# Altium schematic sheet Main.SchDoc
size A1
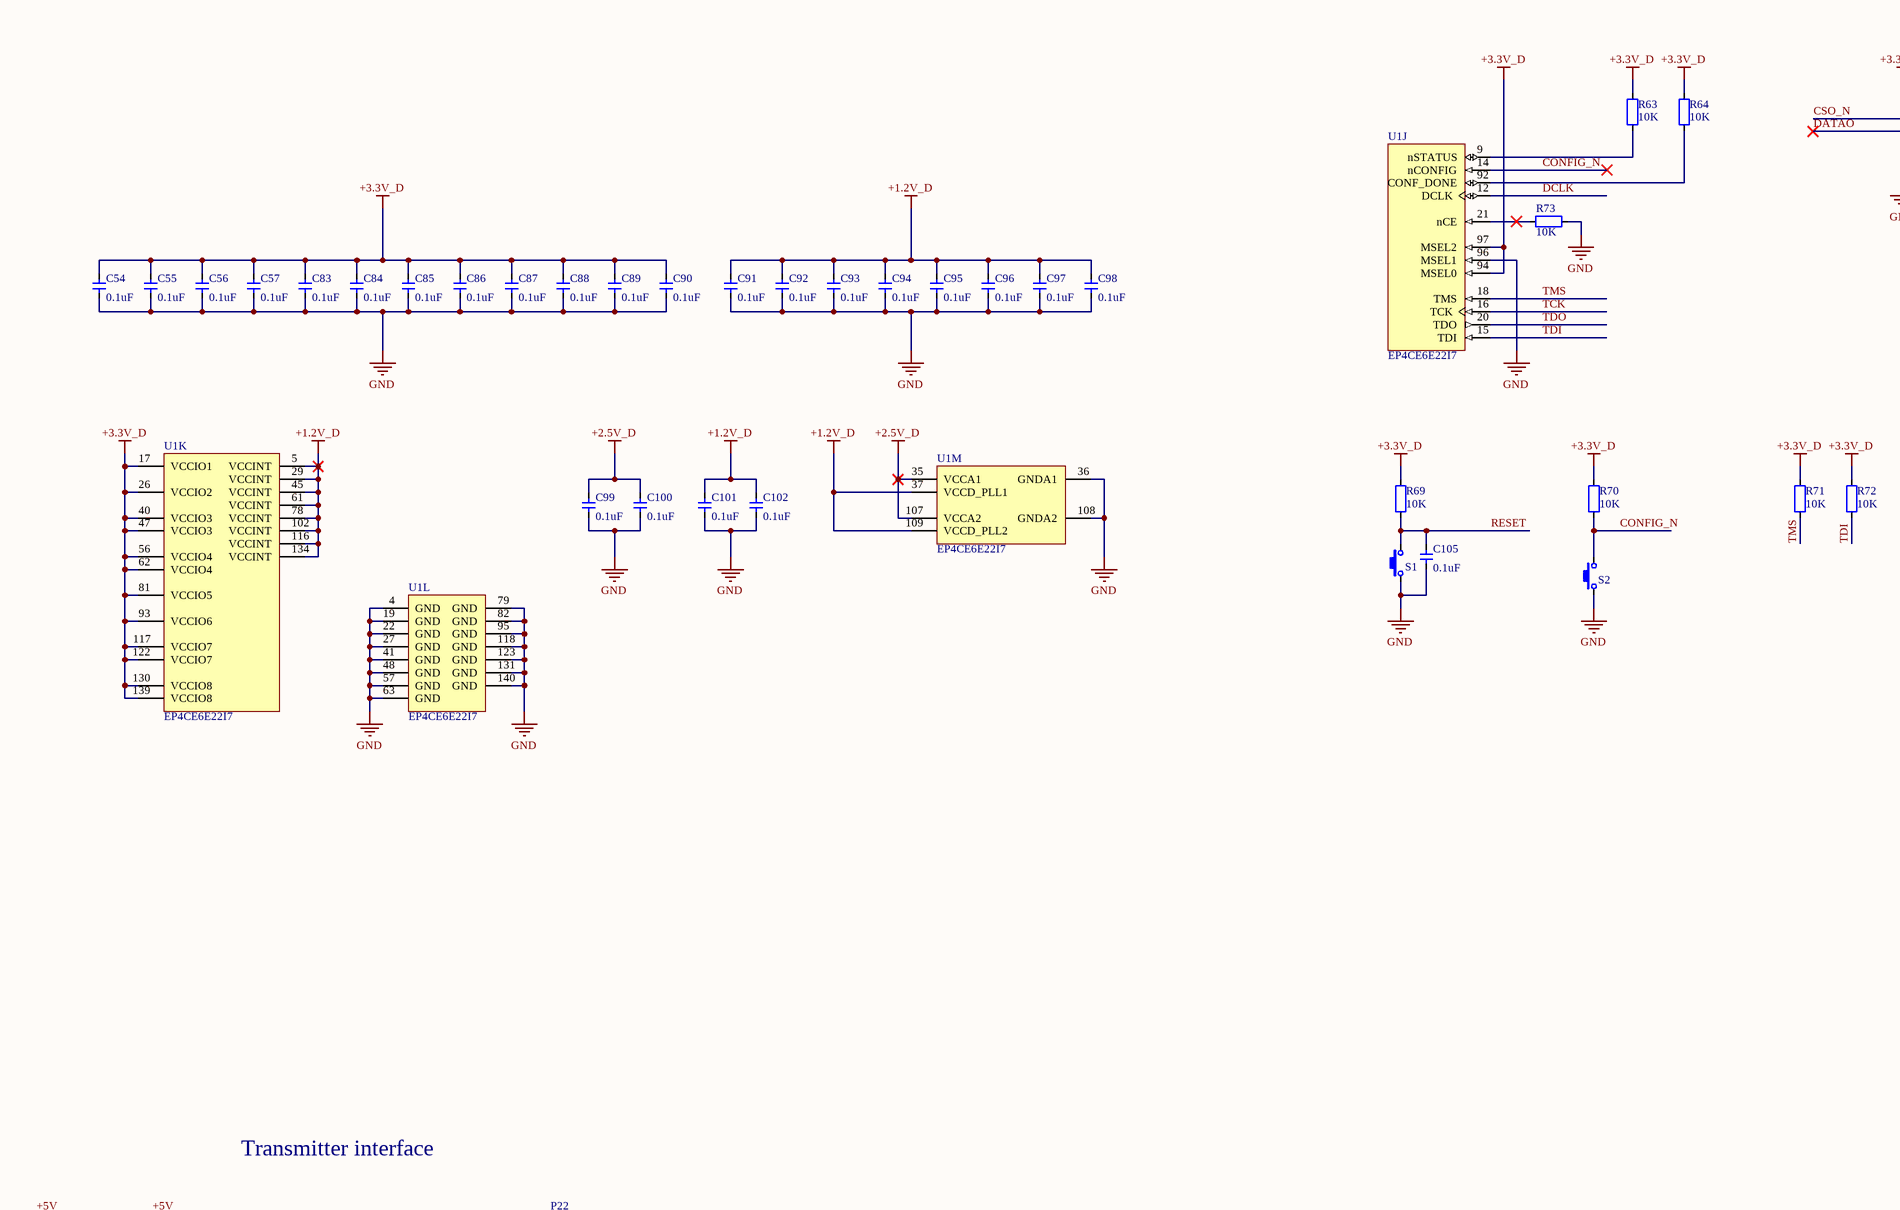
[diagram p0: Main.SchDoc, top left]
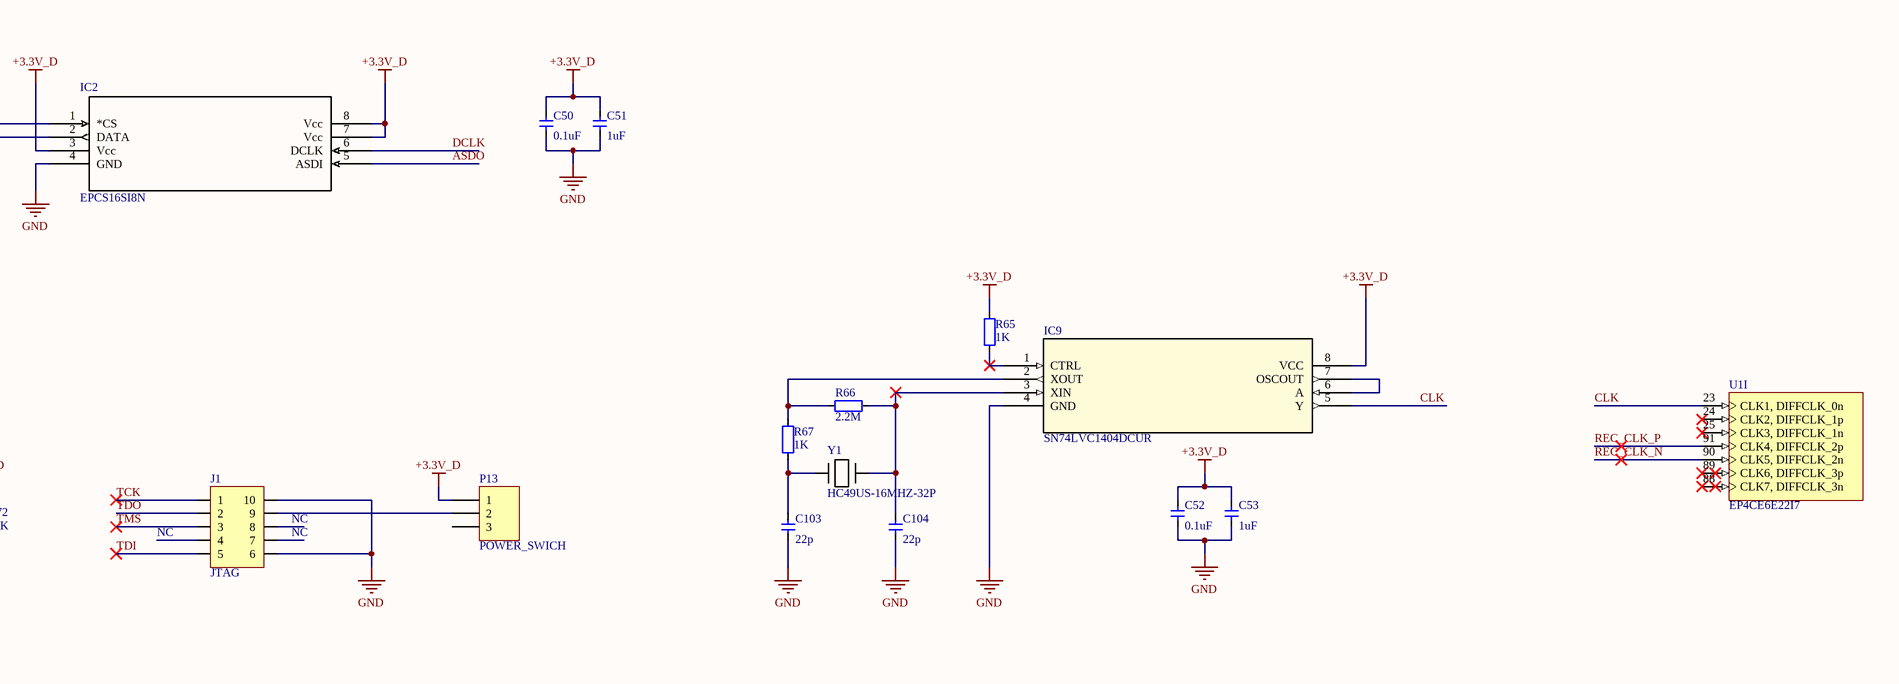
[diagram p1: Main.SchDoc, top right]
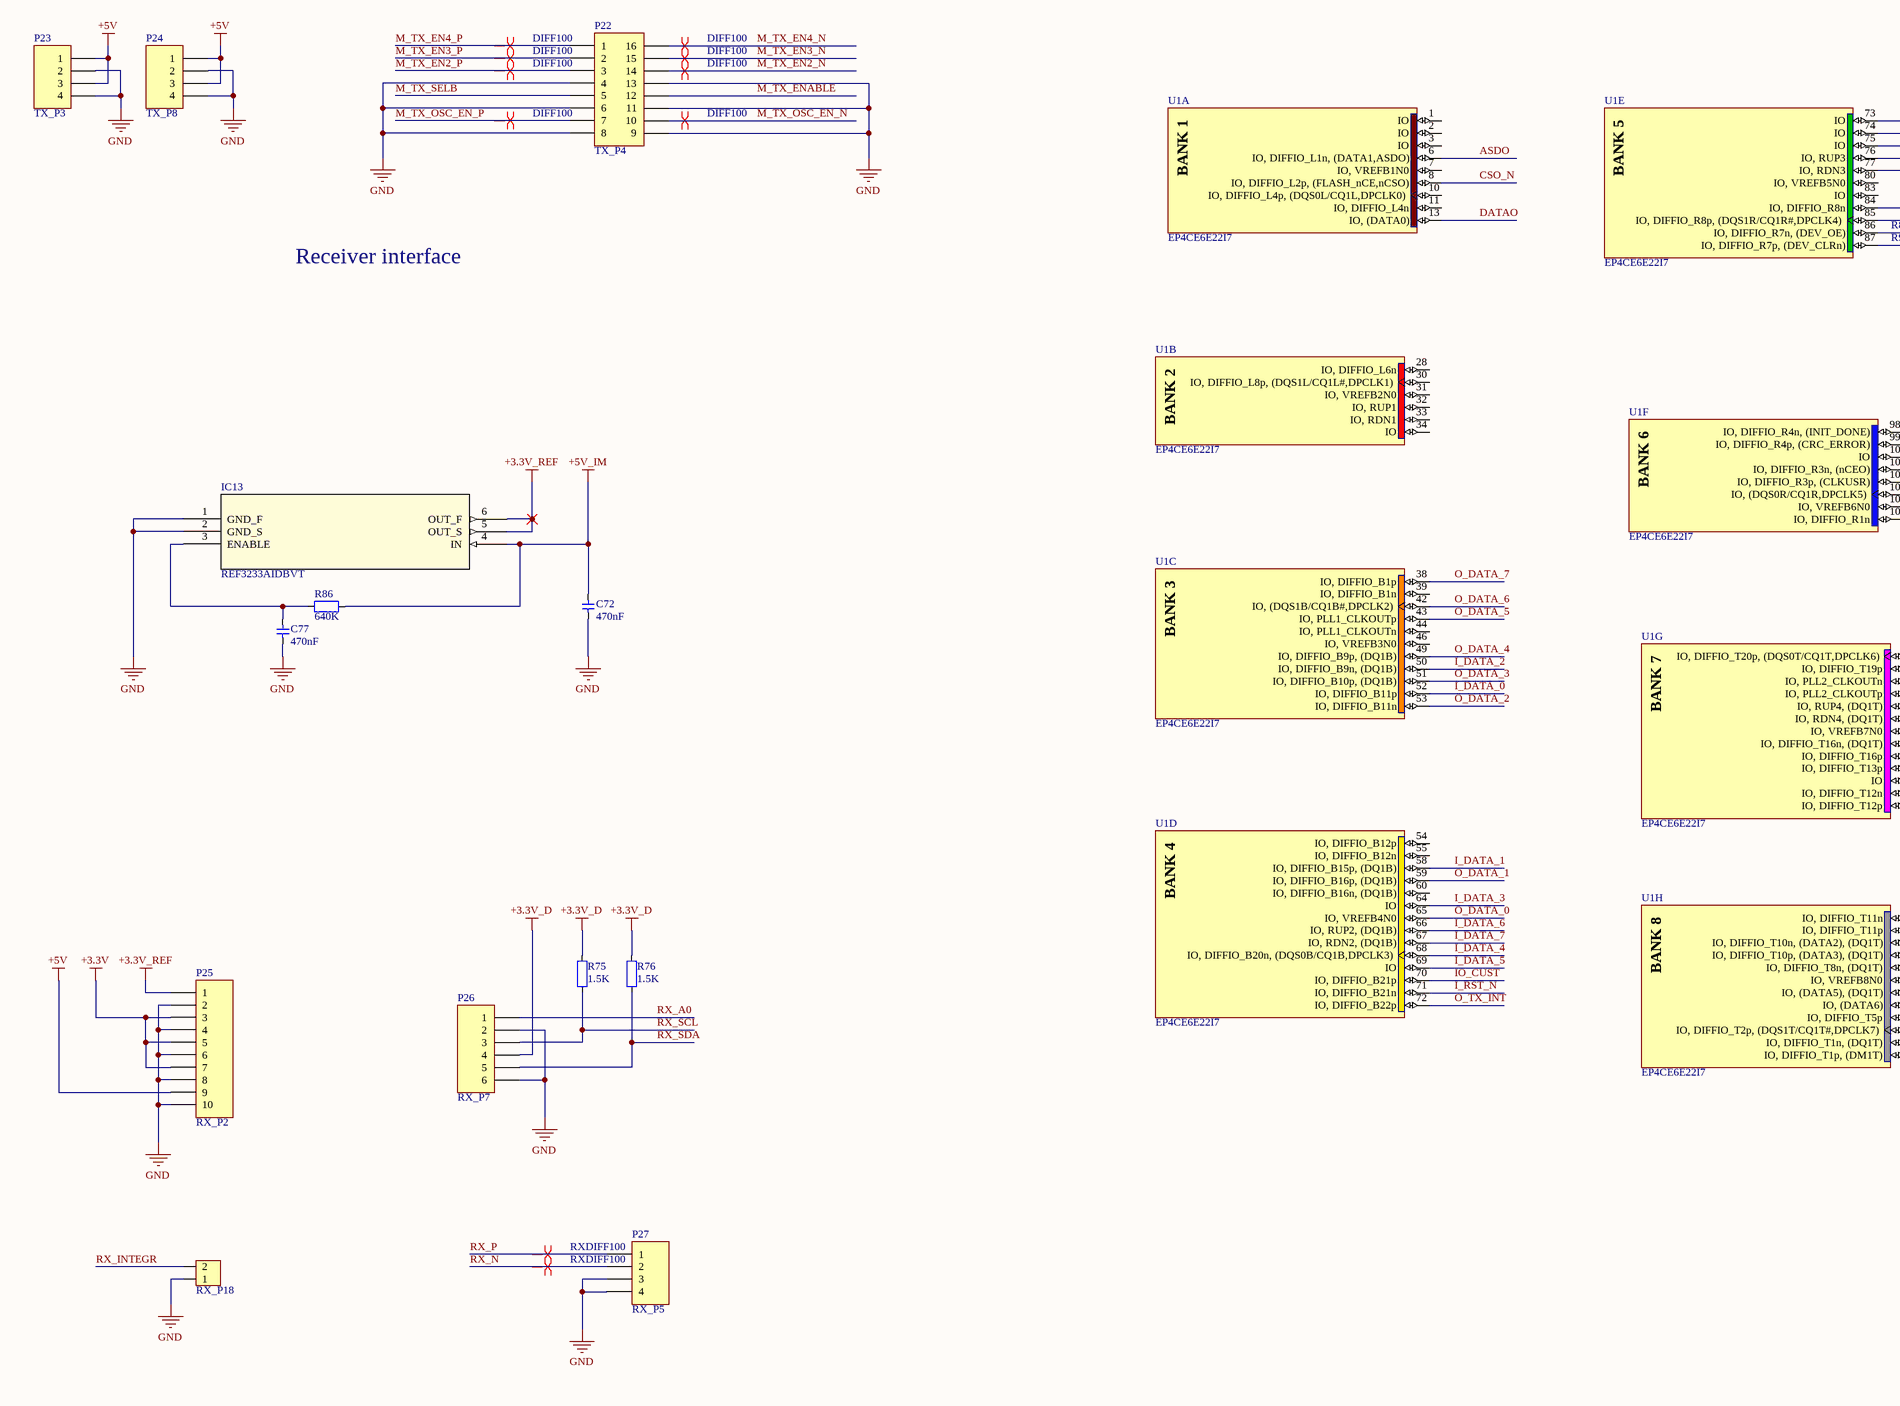
[diagram p2: Main.SchDoc, bottom left]
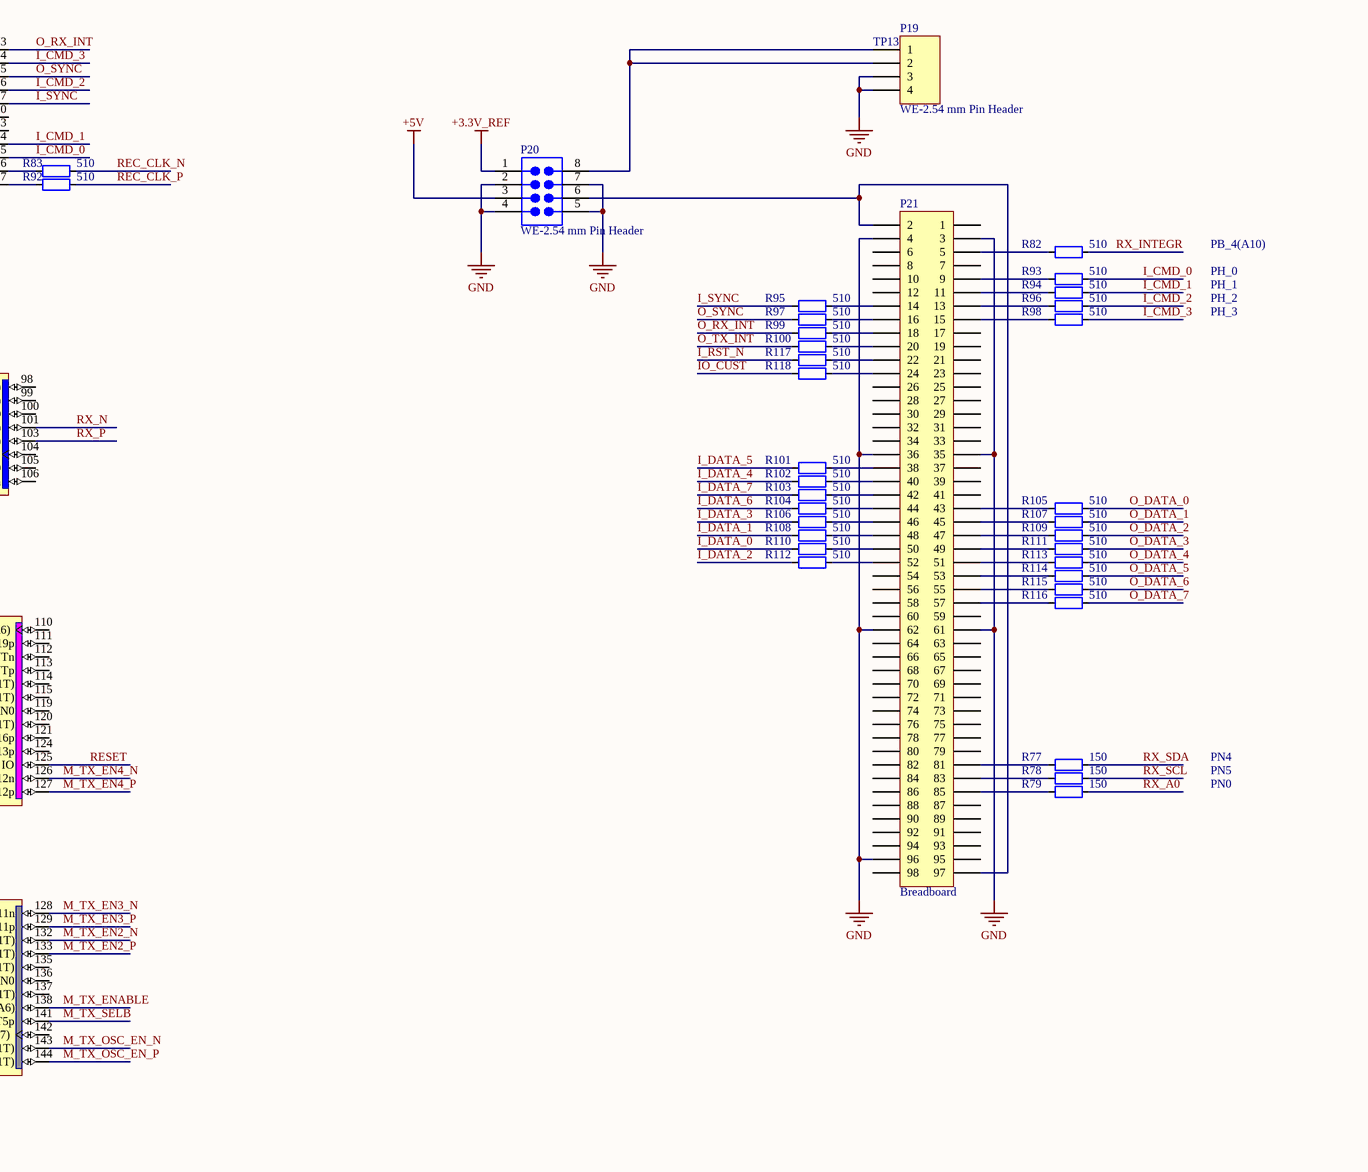
[diagram p3: Main.SchDoc, bottom right]

## Parts
C50  value 0.1uF  [CAP_0603]  (hidden comment: Cap_0603)
C51  value 1uF  [CAP_0603]  (hidden comment: Cap_0603)
C52  value 0.1uF  [CAP_0603]  (hidden comment: Cap_0603)
C53  value 1uF  [CAP_0603]  (hidden comment: Cap_0603)
C54  value 0.1uF  [CAP_0603]  (hidden comment: Cap_0603)
C55  value 0.1uF  [CAP_0603]  (hidden comment: Cap_0603)
C56  value 0.1uF  [CAP_0603]  (hidden comment: Cap_0603)
C57  value 0.1uF  [CAP_0603]  (hidden comment: Cap_0603)
C72  value 470nF  [CAP_0603]  (hidden comment: Cap_0603)
C77  value 470nF  [CAP_0603]  (hidden comment: Cap_0603)
C83  value 0.1uF  [CAP_0603]  (hidden comment: Cap_0603)
C84  value 0.1uF  [CAP_0603]  (hidden comment: Cap_0603)
C85  value 0.1uF  [CAP_0603]  (hidden comment: Cap_0603)
C86  value 0.1uF  [CAP_0603]  (hidden comment: Cap_0603)
C87  value 0.1uF  [CAP_0603]  (hidden comment: Cap_0603)
C88  value 0.1uF  [CAP_0603]  (hidden comment: Cap_0603)
C89  value 0.1uF  [CAP_0603]  (hidden comment: Cap_0603)
C90  value 0.1uF  [CAP_0603]  (hidden comment: Cap_0603)
C91  value 0.1uF  [CAP_0603]  (hidden comment: Cap_0603)
C92  value 0.1uF  [CAP_0603]  (hidden comment: Cap_0603)
C93  value 0.1uF  [CAP_0603]  (hidden comment: Cap_0603)
C94  value 0.1uF  [CAP_0603]  (hidden comment: Cap_0603)
C95  value 0.1uF  [CAP_0603]  (hidden comment: Cap_0603)
C96  value 0.1uF  [CAP_0603]  (hidden comment: Cap_0603)
C97  value 0.1uF  [CAP_0603]  (hidden comment: Cap_0603)
C98  value 0.1uF  [CAP_0603]  (hidden comment: Cap_0603)
C99  value 0.1uF  [CAP_0603]  (hidden comment: Cap_0603)
C100  value 0.1uF  [CAP_0603]  (hidden comment: Cap_0603)
C101  value 0.1uF  [CAP_0603]  (hidden comment: Cap_0603)
C102  value 0.1uF  [CAP_0603]  (hidden comment: Cap_0603)
C103  value 22p  [CAP_0603]  (hidden comment: Cap_0603)
C104  value 22p  [CAP_0603]  (hidden comment: Cap_0603)
C105  value 0.1uF  [CAP_0603]  (hidden comment: Cap_0603)
IC2  EPCS16SI8N  [8-SOIC]
IC9  SN74LVC1404DCUR  [DCU8]
IC13  REF3233AIDBVT  [DBV6]
J1  JTAG  [66101021622]
P13  POWER_SWICH  [61300311121]
P19  WE-2.54 mm Pin Header  [61000418221]
P20  WE-2.54 mm Pin Header  [610x0821121]
P21  Breadboard  [Breadboard]
P22  TX_P4  [61001621821]
P23  TX_P3  [61000411921]
P24  TX_P8  [61000411921]
P25  RX_P2  [61301011821]
P26  RX_P7  [61000613321]
P27  RX_P5  [61000413321]
R63  value 10K  [RES_0603]  (hidden comment: Res_0603)
R64  value 10K  [RES_0603]  (hidden comment: Res_0603)
R65  value 1K  [RES_0603]  (hidden comment: Res_0603)
R66  value 2.2M  [RES_0603]  (hidden comment: Res_0603)
R67  value 1K  [RES_0603]  (hidden comment: Res_0603)
R69  value 10K  [RES_0603]  (hidden comment: Res_0603)
R70  value 10K  [RES_0603]  (hidden comment: Res_0603)
R71  value 10K  [RES_0603]  (hidden comment: Res_0603)
R72  value 10K  [RES_0603]  (hidden comment: Res_0603)
R73  value 10K  [RES_0603]  (hidden comment: Res_0603)
R75  value 1.5K  [RES_0603]  (hidden comment: Res_0603)
R76  value 1.5K  [RES_0603]  (hidden comment: Res_0603)
R77  value 150  [RES_0603]  (hidden comment: Res_0603)
R78  value 150  [RES_0603]  (hidden comment: Res_0603)
R79  value 150  [RES_0603]  (hidden comment: Res_0603)
R82  value 510  [RES_0603]  (hidden comment: Res_0603)
R83  value 510  [RES_0603]  (hidden comment: Res_0603)
R86  value 640K  [RES_0603]  (hidden comment: Res_0603)
R92  value 510  [RES_0603]  (hidden comment: Res_0603)
R93  value 510  [RES_0603]  (hidden comment: Res_0603)
R94  value 510  [RES_0603]  (hidden comment: Res_0603)
R95  value 510  [RES_0603]  (hidden comment: Res_0603)
R96  value 510  [RES_0603]  (hidden comment: Res_0603)
R97  value 510  [RES_0603]  (hidden comment: Res_0603)
R98  value 510  [RES_0603]  (hidden comment: Res_0603)
R99  value 510  [RES_0603]  (hidden comment: Res_0603)
R100  value 510  [RES_0603]  (hidden comment: Res_0603)
R101  value 510  [RES_0603]  (hidden comment: Res_0603)
R102  value 510  [RES_0603]  (hidden comment: Res_0603)
R103  value 510  [RES_0603]  (hidden comment: Res_0603)
R104  value 510  [RES_0603]  (hidden comment: Res_0603)
R105  value 510  [RES_0603]  (hidden comment: Res_0603)
R106  value 510  [RES_0603]  (hidden comment: Res_0603)
R107  value 510  [RES_0603]  (hidden comment: Res_0603)
R108  value 510  [RES_0603]  (hidden comment: Res_0603)
R109  value 510  [RES_0603]  (hidden comment: Res_0603)
R110  value 510  [RES_0603]  (hidden comment: Res_0603)
R111  value 510  [RES_0603]  (hidden comment: Res_0603)
R112  value 510  [RES_0603]  (hidden comment: Res_0603)
R113  value 510  [RES_0603]  (hidden comment: Res_0603)
R114  value 510  [RES_0603]  (hidden comment: Res_0603)
R115  value 510  [RES_0603]  (hidden comment: Res_0603)
R116  value 510  [RES_0603]  (hidden comment: Res_0603)
R117  value 510  [RES_0603]  (hidden comment: Res_0603)
R118  value 510  [RES_0603]  (hidden comment: Res_0603)
RX_P18  HDR1x2_2.54  [HDR1X2_2.54_180F]  (value not drawn)
S1  ButtonTACT_3x6x2.5_180  [ButtonTACT_3x6x2.5_180]  (value not drawn)
S2  ButtonTACT_3x6x2.5_180  [ButtonTACT_3x6x2.5_180]  (value not drawn)
U1  EP4CE6E22I7  [EQFP144_N]  (parts A,B,C,D,E,F,G,H,I,J,K,L,M of 13)
Y1  HC49US-16MHZ-32P  [H25]

## Nets
+1.2V_D: C91.2 C92.2 C93.2 C94.2 C95.2 C96.2 C97.2 C98.2 C101.2 C102.2 U1.5(VCCINT) U1.29(VCCINT) U1.37(VCCD_PLL1) U1.45(VCCINT) U1.61(VCCINT) U1.78(VCCINT) U1.102(VCCINT) U1.109(VCCD_PLL2) U1.116(VCCINT) U1.134(VCCINT)
+2.5V_D: C99.2 C100.2 U1.35(VCCA1) U1.107(VCCA2)
+3.3V: P25.3 P25.5 P25.7
+3.3V_D: C50.2 C51.2 C52.2 C53.2 C54.2 C55.2 C56.2 C57.2 C83.2 C84.2 C85.2 C86.2 C87.2 C88.2 C89.2 C90.2 IC2.3(Vcc) IC2.7(Vcc) IC2.8(Vcc) IC9.8(VCC) P13.1 P26.4 R63.1 R64.1 R65.1 R69.1 R70.1 R71.1 R72.1 R75.2 R76.2 U1.17(VCCIO1) U1.26(VCCIO2) U1.40(VCCIO3) U1.47(VCCIO3) U1.56(VCCIO4) U1.62(VCCIO4) U1.81(VCCIO5) U1.93(VCCIO6) U1.94(MSEL0) U1.97(MSEL2) U1.117(VCCIO7) U1.122(VCCIO7) U1.130(VCCIO8) U1.139(VCCIO8)
+3.3V_REF: IC13.5(OUT_S) IC13.6(OUT_F) P20.1 P25.1
+5V: P20.3 P23.1 P23.3 P24.1 P24.3 P25.9
+5V_IM: C72.2 IC13.4(IN) R86.2
GND: C50.1 C51.1 C52.1 C53.1 C54.1 C55.1 C56.1 C57.1 C72.1 C77.1 C83.1 C84.1 C85.1 C86.1 C87.1 C88.1 C89.1 C90.1 C91.1 C92.1 C93.1 C94.1 C95.1 C96.1 C97.1 C98.1 C99.1 C100.1 C101.1 C102.1 C103.1 C104.1 C105.1 IC2.4(GND) IC9.4(GND) IC13.1(GND_F) IC13.2(GND_S) J1.6 J1.10 P19.3 P19.4 P20.2 P20.4 P20.5 P20.7 P21.3 P21.4 P21.35 P21.36 P21.61 P21.62 P21.96 P22.4 P22.6 P22.8 P22.9 P22.11 P22.13 P23.2 P23.4 P24.2 P24.4 P25.2 P25.4 P25.6 P25.8 P25.10 P26.2 P26.6 P27.3 P27.4 R73.2 RX_P18.1 S1.1 S2.1 U1.4(GND) U1.19(GND) U1.22(GND) U1.27(GND) U1.36(GNDA1) U1.41(GND) U1.48(GND) U1.57(GND) U1.63(GND) U1.79(GND) U1.82(GND) U1.95(GND) U1.96(MSEL1) U1.108(GNDA2) U1.118(GND) U1.123(GND) U1.131(GND) U1.140(GND)
ASDO: IC2.5(ASDI) U1.6(IO,_DIFFIO_L1n,_(DATA1,ASDO))
CLK: IC9.5(Y) U1.23(CLK1,_DIFFCLK_0n)
CONFIG_N: R70.2 S2.2 U1.14(nCONFIG)
CSO_N: IC2.1(*CS) U1.8(IO,_DIFFIO_L2p,_(FLASH_nCE,nCSO))
DATAO: IC2.2(DATA) U1.13(IO,_(DATA0))
DCLK: IC2.6(DCLK) U1.12(DCLK)
I_CMD_0: R93.1 U1.85(IO,_DIFFIO_R8p,_(DQS1R/CQ1R#,DPCLK4))
I_CMD_1: R94.1 U1.84(IO,_DIFFIO_R8n)
I_CMD_2: R96.1 U1.76(IO,_RUP3)
I_CMD_3: R98.1 U1.74(IO)
I_DATA_0: R110.2 U1.52(IO,_DIFFIO_B11p)
I_DATA_1: R108.2 U1.58(IO,_DIFFIO_B15p,_(DQ1B))
I_DATA_2: R112.2 U1.50(IO,_DIFFIO_B9n,_(DQ1B))
I_DATA_3: R106.2 U1.64(IO)
I_DATA_4: R102.2 U1.68(IO,_DIFFIO_B20n,_(DQS0B/CQ1B,DPCLK3))
I_DATA_5: R101.2 U1.69(IO)
I_DATA_6: R104.2 U1.66(IO,_RUP2,_(DQ1B))
I_DATA_7: R103.2 U1.67(IO,_RDN2,_(DQ1B))
I_RST_N: R117.2 U1.71(IO,_DIFFIO_B21n)
I_SYNC: R95.2 U1.77(IO,_RDN3)
IO_CUST: R118.2 U1.70(IO,_DIFFIO_B21p)
M_TX_EN2_N: P22.14 U1.132(IO,_DIFFIO_T10n,_(DATA2),_(DQ1T))
M_TX_EN2_P: P22.3 U1.133(IO,_DIFFIO_T10p,_(DATA3),_(DQ1T))
M_TX_EN3_N: P22.15 U1.128(IO,_DIFFIO_T11n)
M_TX_EN3_P: P22.2 U1.129(IO,_DIFFIO_T11p)
M_TX_EN4_N: P22.16 U1.126(IO,_DIFFIO_T12n)
M_TX_EN4_P: P22.1 U1.127(IO,_DIFFIO_T12p)
M_TX_ENABLE: P22.12 U1.138(IO,_(DATA6))
M_TX_OSC_EN_N: P22.10 U1.143(IO,_DIFFIO_T1n,_(DQ1T))
M_TX_OSC_EN_P: P22.7 U1.144(IO,_DIFFIO_T1p,_(DM1T))
M_TX_SELB: P22.5 U1.141(IO,_DIFFIO_T5p)
O_DATA_0: R105.1 U1.65(IO,_VREFB4N0)
O_DATA_1: R107.1 U1.59(IO,_DIFFIO_B16p,_(DQ1B))
O_DATA_2: R109.1 U1.53(IO,_DIFFIO_B11n)
O_DATA_3: R111.1 U1.51(IO,_DIFFIO_B10p,_(DQ1B))
O_DATA_4: R113.1 U1.49(IO,_DIFFIO_B9p,_(DQ1B))
O_DATA_5: R114.1 U1.43(IO,_PLL1_CLKOUTp)
O_DATA_6: R115.1 U1.42(IO,_(DQS1B/CQ1B#,DPCLK2))
O_DATA_7: R116.1 U1.38(IO,_DIFFIO_B1p)
O_RX_INT: R99.2 U1.73(IO)
O_SYNC: R97.2 U1.75(IO)
O_TX_INT: R100.2 U1.72(IO,_DIFFIO_B22p)
REC_CLK_N: R83.1 U1.90(CLK5,_DIFFCLK_2n)
REC_CLK_P: R92.1 U1.91(CLK4,_DIFFCLK_2p)
RESET: C105.2 R69.2 S1.2 U1.125(IO)
RX_A0: P26.1 R79.1
RX_INTEGR: R82.1 RX_P18.2
RX_N: P27.2 U1.101(IO,_DIFFIO_R3n,_(nCEO))
RX_P: P27.1 U1.103(IO,_DIFFIO_R3p,_(CLKUSR))
RX_SCL: P26.3 R75.1 R78.1
RX_SDA: P26.5 R76.1 R77.1
TCK: J1.1 U1.16(TCK)
TDI: J1.5 R72.2 U1.15(TDI)
TDO: J1.2 U1.20(TDO)
TMS: J1.3 R71.2 U1.18(TMS)
NetC77_2: C77.2 IC13.3(ENABLE) R86.1
NetC103_2: C103.2 R67.2 Y1.1
NetC104_2: C104.2 IC9.3(XIN) R66.1 Y1.2
NetIC9_1: IC9.1(CTRL) R65.2
NetIC9_2: IC9.2(XOUT) R66.2 R67.1
NetIC9_6: IC9.6(A) IC9.7(OSCOUT)
NetJ1_9: J1.9 P13.2
NetP19_1: P19.1 P19.2 P20.8
NetP20_6: P20.6 P21.2 P21.97
NetP21_5: P21.5 R82.2
NetP21_9: P21.9 R93.2
NetP21_11: P21.11 R94.2
NetP21_13: P21.13 R96.2
NetP21_14: P21.14 R95.1
NetP21_15: P21.15 R98.2
NetP21_16: P21.16 R97.1
NetP21_18: P21.18 R99.1
NetP21_20: P21.20 R100.1
NetP21_22: P21.22 R117.1
NetP21_24: P21.24 R118.1
NetP21_38: P21.38 R101.1
NetP21_40: P21.40 R102.1
NetP21_42: P21.42 R103.1
NetP21_43: P21.43 R105.2
NetP21_44: P21.44 R104.1
NetP21_45: P21.45 R107.2
NetP21_46: P21.46 R106.1
NetP21_47: P21.47 R109.2
NetP21_48: P21.48 R108.1
NetP21_49: P21.49 R111.2
NetP21_50: P21.50 R110.1
NetP21_51: P21.51 R113.2
NetP21_52: P21.52 R112.1
NetP21_53: P21.53 R114.2
NetP21_55: P21.55 R115.2
NetP21_57: P21.57 R116.2
NetP21_81: P21.81 R77.2
NetP21_83: P21.83 R78.2
NetP21_85: P21.85 R79.2
NetR63_2: R63.2 U1.9(nSTATUS)
NetR64_2: R64.2 U1.92(CONF_DONE)
NetR73_1: R73.1 U1.21(nCE)
NetR83_2: R83.2 U1.86(IO,_DIFFIO_R7n,_(DEV_OE))
NetR92_2: R92.2 U1.87(IO,_DIFFIO_R7p,_(DEV_CLRn))

Not connected (* = marked no-connect by the designer): J1 4 7 8; P13 3; P21 1 6 7 8 10 12 17 19 21 23 25 26 27 28 29 30 31 32 33 34 37 39 41 54 56 58 59 60 63 64 65 66 67 68 69 70 71 72 73 74 75 76 77 78 79 80 82 84 86 87 88 89 90 91 92 93 94 95 98; U1 1(IO) 2(IO) 3(IO) 7(IO,_VREFB1N0) 10(IO,_DIFFIO_L4p,_(DQS0L/CQ1L,DPCLK0)) 11(IO,_DIFFIO_L4n) 24(CLK2,_DIFFCLK_1p)* 25(CLK3,_DIFFCLK_1n)* 28(IO,_DIFFIO_L6n) 30(IO,_DIFFIO_L8p,_(DQS1L/CQ1L#,DPCLK1)) 31(IO,_VREFB2N0) 32(IO,_RUP1) 33(IO,_RDN1) 34(IO) 39(IO,_DIFFIO_B1n) 44(IO,_PLL1_CLKOUTn) 46(IO,_VREFB3N0) 54(IO,_DIFFIO_B12p) 55(IO,_DIFFIO_B12n) 60(IO,_DIFFIO_B16n,_(DQ1B)) 80(IO,_VREFB5N0) 83(IO) 88(CLK7,_DIFFCLK_3n)* 89(CLK6,_DIFFCLK_3p)* 98(IO,_DIFFIO_R4n,_(INIT_DONE)) 99(IO,_DIFFIO_R4p,_(CRC_ERROR)) 100(IO) 104(IO,_(DQS0R/CQ1R,DPCLK5)) 105(IO,_VREFB6N0) 106(IO,_DIFFIO_R1n) 110(IO,_DIFFIO_T20p,_(DQS0T/CQ1T,DPCLK6)) 111(IO,_DIFFIO_T19p) 112(IO,_PLL2_CLKOUTn) 113(IO,_PLL2_CLKOUTp) 114(IO,_RUP4,_(DQ1T)) 115(IO,_RDN4,_(DQ1T)) 119(IO,_VREFB7N0) 120(IO,_DIFFIO_T16n,_(DQ1T)) 121(IO,_DIFFIO_T16p) 124(IO,_DIFFIO_T13p) 135(IO,_DIFFIO_T8n,_(DQ1T)) 136(IO,_VREFB8N0) 137(IO,_(DATA5),_(DQ1T)) 142(IO,_DIFFIO_T2p,_(DQS1T/CQ1T#,DPCLK7))

## Layout directives
differential pair; net class DIFF100: M_TX_EN2_N, M_TX_EN2_P, M_TX_EN3_N, M_TX_EN3_P, M_TX_EN4_N, M_TX_EN4_P, M_TX_OSC_EN_N, M_TX_OSC_EN_P
differential pair; net class RXDIFF100: RX_N, RX_P

## Notes on the sheet
- (near J1) NC
- Transmitter interface
- (near P19) TP13
- Receiver interface
- PB_4(A10)
- PH_0
- PH_1
- PH_2
- PH_3
- PN4
- PN5
- PN0
- (in symbol EP4CE6E22I7, part A) BANK 1
- (in symbol EP4CE6E22I7, part B) BANK 2
- (in symbol EP4CE6E22I7, part C) BANK 3
- (in symbol EP4CE6E22I7, part D) BANK 4
- (in symbol EP4CE6E22I7, part E) BANK 5
- (in symbol EP4CE6E22I7, part F) BANK 6
- (in symbol EP4CE6E22I7, part G) BANK 7
- (in symbol EP4CE6E22I7, part H) BANK 8

## Library data of the parts
C50-C57 C72 C77 C83-C105 = Cap_0603: Capacitor
IC2 = EPCS16SI8N: Imported; Voltage - Supply: 3 V ~ 3.6 V; Memory Size: 16Mb; Programmable Type: In System Programmable; Vendor: Altera; C: Copyright (C) 2015 Accelerated Designs. All rights reserved; NewarkPartNumber: 80P4116; Operating Temperature: -40В°C ~ 85В°C; Packaging: Tube; Package / Case: 8-SOIC (0.154", 3.90mm Width); DigiKeyPartNumber: 544-2567-5-ND; Manufacturer_Part_Number: EPCS16SI8N; Quantity_Available: 6694; DataSheet: http://www.altera.com/literature/hb/cfg/cyc_c51014.pdf; Supplier Device Package: 8-SOIC; Copyright: Copyright (C) 2015 Accelerated Designs. All rights reserved; RefDes: RefDes; Type: DEV; Value: Value
IC9 = SN74LVC1404DCUR: Imported; Vendor: Texas Instruments; PACKAGE_DESIGNATOR: DCU; PIN_COUNT: 8; FAMILY_NAME: INVERTING BUFFER/DRIVER; INDUSTRY_STD_PKG_TYPE: US8; 3D_Library_Name: TI_AllParts_2012-12-25; C: Copyright (C) 2015 Accelerated Designs. All rights reserved; Manufacturer_Part_Number: SN74LVC1404DCUR; GENERIC_PART_NUMBER: SN74LVC1404; Datasheet URL: http://www.ti.com/lit/gpn/SN74LVC1404; Manufacturer: Texas Instruments; Copyright: Copyright (C) 2015 Accelerated Designs. All rights reserved; RefDes: RefDes; Type: DEV; Value: Value
IC13 = REF3233AIDBVT: Imported; Manufacturer: Texas Instruments; Manufacturer_Part_Number: ref3233_dbv_6; INDUSTRY_STD_PKG_TYPE: SOT-23; FAMILY_NAME: SERIES VOLTAGE REFERENCE; PIN_COUNT: 6; PACKAGE_DESIGNATOR: DBV; C: Copyright (C) 2015 Accelerated Designs. All rights reserved; Datasheet URL: http://www.ti.com/lit/gpn/REF3233; GENERIC_PART_NUMBER: REF3233; Vendor: Texas Instruments; Copyright: Copyright (C) 2015 Accelerated Designs. All rights reserved; RefDes: RefDes; Type: DEV; Value: Value
J1 = WR-WTB, 66101021622: WR-WTB 2.54mm Shrouded Header_Straight; Manufacturer: Wurth Elektronik; ComponentLink1 Description: Manufacturer; ComponentLink2 Description: Datasheet; NoPins: 10; Created Date: 9.Oct.2015; partNo: 66101021622; ComponentLink1URL: http://www.we-online.com; ComponentLink2URL: http://katalog.we-online.de/em/datasheet/6610XX11622.pdf; Created by: Baojun Chen
P13 = WE-2.54 mm Pin Header & Jumper 61300311121: WR-PHD 2.54mm Pin Header; Manufacturer: WЁ№rth Elektronik eiSos GmbH; ComponentLink1 Description: Manufacturer; ComponentLink2 Description: Datasheet; NoPins: 03; Created Date: 22 March 2013; partNo: 61300311121; ComponentLink1URL: http://www.we-online.com; ComponentLink2URL: http://katalog.we-online.de/em/datasheet/6130xx11121.pdf; Created by: Karrer Zheng
P19 = WE-2.54 mm Pin Header & Jumper 61000418221: WR-PHD 2.54 mm SMT Pin Header; Manufacturer: WЁ№rth Elektronik eiSos GmbH; ComponentLink1 Description: Manufacturer; ComponentLink2 Description: Datasheet; NoPins: 04; Created Date: 26 March 2013; partNo: 61000418221; ComponentLink1URL: http://www.we-online.com; ComponentLink2URL: http://katalog.we-online.de/em/datasheet/6100xx18221.pdf; Created by: Karrer Zheng
P20 = WE-2.54 mm Pin Header & Jumper 610x0821121: WR-PHD 2.54 mm Dual SMT Pin Header; Manufacturer: WЁ№rth Elektronik eiSos GmbH; ComponentLink1 Description: Manufacturer; ComponentLink2 Description: Datasheet; NoPins: 08; Created Date: 22 March 2013; partNo: 610x0821121; ComponentLink1URL: http://www.we-online.com; ComponentLink2URL: http://katalog.we-online.de/em/datasheet/6100xx21121.pdf; Created by: Karrer Zheng
P21 = Breadboard connection 2.54mm: NoPins: 98; Created Date: 3 July 2016; Created by: Maksym Hilliaka
P22 = WE-2.54 mm Socket Header 61001621821: WR-PHD 2.54 mm Dual SMT Socket Header; Manufacturer: WЁ№rth Elektronik eiSos GmbH; ComponentLink1 Description: Manufacturer; ComponentLink2 Description: Datasheet; NoPins: 16; Created Date: 29 March 2013; partNo: 61001621821; ComponentLink1URL: http://www.we-online.com; ComponentLink2URL: http://katalog.we-online.de/em/datasheet/6100xx21821.pdf; Created by: Karrer Zheng
P23 P24 = WE-2.54 mm Socket Header 61000411921: WR-PHD 2.54 mm SMT Socket Header; Manufacturer: WЁ№rth Elektronik eiSos GmbH; ComponentLink1 Description: Manufacturer; ComponentLink2 Description: Datasheet; NoPins: 4; Created Date: 29 March 2013; partNo: 61000411921; ComponentLink1URL: http://www.we-online.com; ComponentLink2URL: http://katalog.we-online.de/em/datasheet/6100xx11921.pdf; Created by: Karrer Zheng
P25 = WE-2.54 mm Socket Header 61301011821: WR-PHD 2.54 mm Socket Header; Manufacturer: WЁ№rth Elektronik eiSos GmbH; ComponentLink1 Description: Manufacturer; ComponentLink2 Description: Datasheet; NoPins: 10; Created Date: 29 March 2013; partNo: 61301011821; ComponentLink1URL: http://www.we-online.com; ComponentLink2URL: http://katalog.we-online.de/em/datasheet/6130xx11821.pdf; Created by: Karrer Zheng
P26 = WE-2.54 mm Socket Header 61000613321: WR-PHD 2.54 mm SMT Socket Header; Manufacturer: WЁ№rth Elektronik eiSos GmbH; ComponentLink1 Description: Manufacturer; ComponentLink2 Description: Datasheet; NoPins: 6; Created Date: 29 March 2013; partNo: 61000613321; ComponentLink1URL: http://www.we-online.com; ComponentLink2URL: http://katalog.we-online.de/em/datasheet/6100xx11921.pdf; Created by: Karrer Zheng
P27 = WE-2.54 mm Socket Header 61000413321: WR-PHD 2.54 mm SMT Socket Header; Manufacturer: WЁ№rth Elektronik eiSos GmbH; ComponentLink1 Description: Manufacturer; ComponentLink2 Description: Datasheet; NoPins: 4; Created Date: 29 March 2013; partNo: 61000413321; ComponentLink1URL: http://www.we-online.com; ComponentLink2URL: http://katalog.we-online.de/em/datasheet/6100xx11921.pdf; Created by: Karrer Zheng
R63-R67 R69-R73 R75-R79 R82 R83 R86 R92-R118 = Res_0603: Resistor
RX_P18 = HDR1x2_2.54T: Header
S1 S2 = ButtonTACT_3x6x2.5_180: Button
U1 = EP4CE6E22I7: Cyclone IV Family FPGA, 2V Core, 91 I/O Pins, 2 PLLs, 144-Pin QFP, Speed Grade 7, Industrial Grade; Published: 3-May-2010; DatasheetVersion: ver1.2, Mar-2010; PackageVersion: ver16.0, Dec-2009; PackageReference: EQFP144; Publisher: Altium Limited; PackageDescription: 144-Pin Plastic Enhanced Quad Flat Pack (EQFP144) - Wire Bond; Supplier 1: Digi-Key; Supplier Part Number 1: EP4CE6E22I7-ND; Code_JEDEC: MS-026-BFB; ComponentLink1Description: Manufacturer Link; ComponentLink1URL: http://www.altera.com/; ComponentLink2Description: Handbook; ComponentLink2URL: http://www.altera.com/literature/hb/cyclone-iv/cyclone4-handbook.pdf; ComponentLink3Description: Pinout Specification; ComponentLink3URL: http://www.altera.com/literature/lit-dp.jsp?category=cyc%204&showspreadsheet=y; ComponentLink4Description: Packaging Specification; ComponentLink4URL: http://www.altera.com/literature/ds/dspkg.pdf
Y1 = HC49US-25MHZ-32P: Imported; Manufacturer_Part_Number: HC49/US-25MHz-32pF-3OT-30-EXT-SMD-H25-TR; Vendor: Rami Technology; C: Copyright (C) 2015 Accelerated Designs. All rights reserved; Copyright: Copyright (C) 2015 Accelerated Designs. All rights reserved; RefDes: RefDes; Type: DEV; Value: Value